# Altium schematic sheet Displaying Unit.SchDoc
size B; SheetNumber: 1; SheetTotal: 1
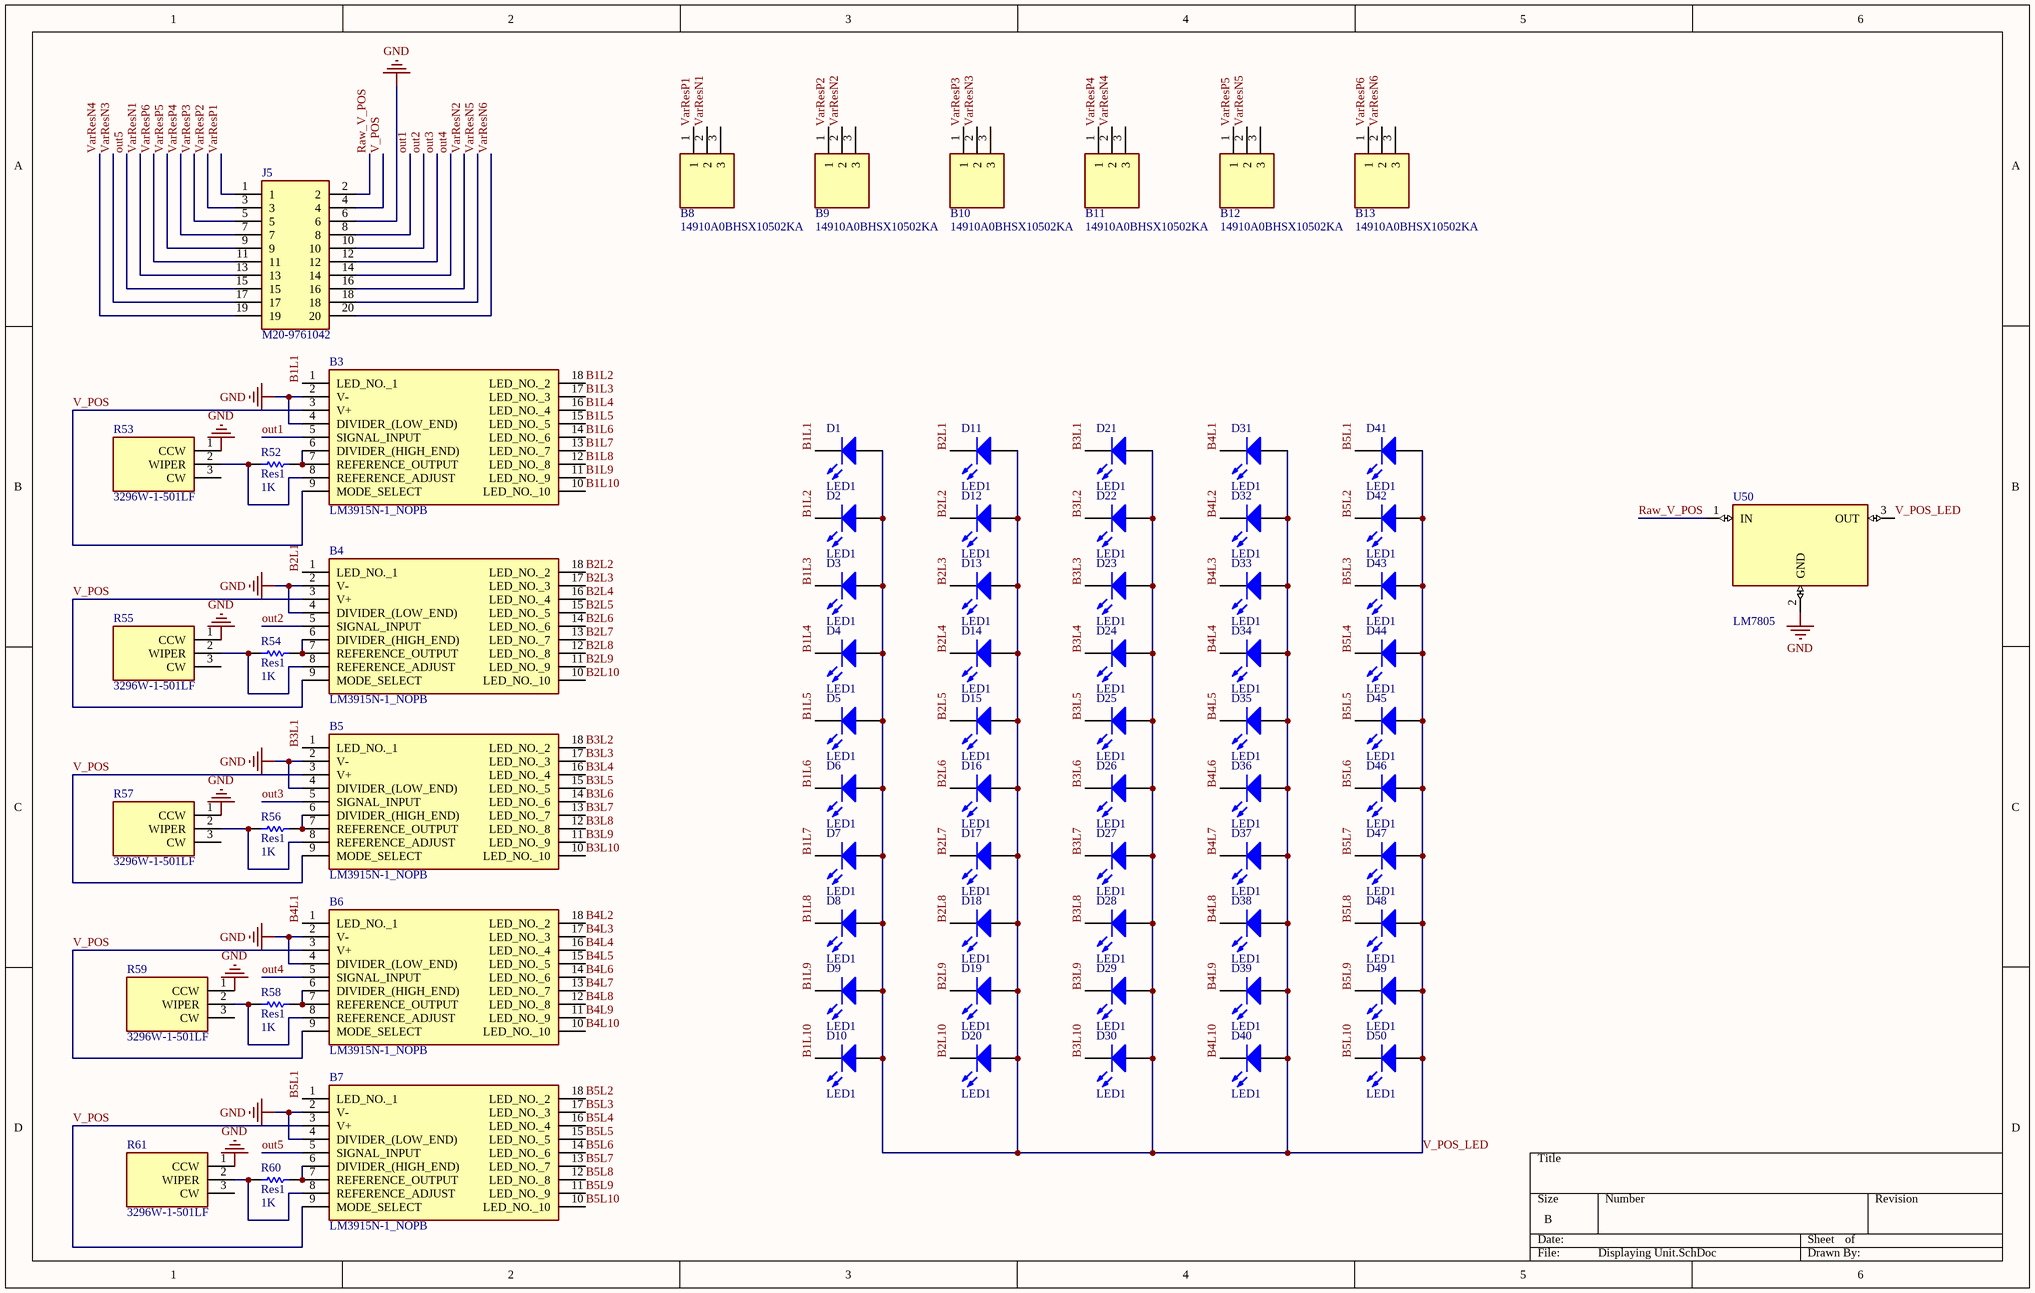
[diagram p0: Displaying Unit.SchDoc]

## Parts
B3  LM3915N-1_NOPB  [DIP794W56P254L2286H533Q18N]
B4  LM3915N-1_NOPB  [DIP794W56P254L2286H533Q18N]
B5  LM3915N-1_NOPB  [DIP794W56P254L2286H533Q18N]
B6  LM3915N-1_NOPB  [DIP794W56P254L2286H533Q18N]
B7  LM3915N-1_NOPB  [DIP794W56P254L2286H533Q18N]
B8  14910A0BHSX10502KA  [14910F0GJSX10103KA]
B9  14910A0BHSX10502KA  [14910F0GJSX10103KA]
B10  14910A0BHSX10502KA  [14910F0GJSX10103KA]
B11  14910A0BHSX10502KA  [14910F0GJSX10103KA]
B12  14910A0BHSX10502KA  [14910F0GJSX10103KA]
B13  14910A0BHSX10502KA  [14910F0GJSX10103KA]
D1  LED1  [LED-1]
D2  LED1  [LED-1]
D3  LED1  [LED-1]
D4  LED1  [LED-1]
D5  LED1  [LED-1]
D6  LED1  [LED-1]
D7  LED1  [LED-1]
D8  LED1  [LED-1]
D9  LED1  [LED-1]
D10  LED1  [LED-1]
D11  LED1  [LED-1]
D12  LED1  [LED-1]
D13  LED1  [LED-1]
D14  LED1  [LED-1]
D15  LED1  [LED-1]
D16  LED1  [LED-1]
D17  LED1  [LED-1]
D18  LED1  [LED-1]
D19  LED1  [LED-1]
D20  LED1  [LED-1]
D21  LED1  [LED-1]
D22  LED1  [LED-1]
D23  LED1  [LED-1]
D24  LED1  [LED-1]
D25  LED1  [LED-1]
D26  LED1  [LED-1]
D27  LED1  [LED-1]
D28  LED1  [LED-1]
D29  LED1  [LED-1]
D30  LED1  [LED-1]
D31  LED1  [LED-1]
D32  LED1  [LED-1]
D33  LED1  [LED-1]
D34  LED1  [LED-1]
D35  LED1  [LED-1]
D36  LED1  [LED-1]
D37  LED1  [LED-1]
D38  LED1  [LED-1]
D39  LED1  [LED-1]
D40  LED1  [LED-1]
D41  LED1  [LED-1]
D42  LED1  [LED-1]
D43  LED1  [LED-1]
D44  LED1  [LED-1]
D45  LED1  [LED-1]
D46  LED1  [LED-1]
D47  LED1  [LED-1]
D48  LED1  [LED-1]
D49  LED1  [LED-1]
D50  LED1  [LED-1]
J5  M20-9761042  [HDRV20W64P254_2X10_2540X508X838P]
R52  Res1  value 1K  [AXIAL-0.3]
R53  3296W-1-501LF  [3296W1501LF]
R54  Res1  value 1K  [AXIAL-0.3]
R55  3296W-1-501LF  [3296W1501LF]
R56  Res1  value 1K  [AXIAL-0.3]
R57  3296W-1-501LF  [3296W1501LF]
R58  Res1  value 1K  [AXIAL-0.3]
R59  3296W-1-501LF  [3296W1501LF]
R60  Res1  value 1K  [AXIAL-0.3]
R61  3296W-1-501LF  [3296W1501LF]
U50  LM7805  [TO220]

## Nets
GND: B3.2(V-) B3.4(DIVIDER_(LOW_END)) B4.2(V-) B4.4(DIVIDER_(LOW_END)) B5.2(V-) B5.4(DIVIDER_(LOW_END)) B6.2(V-) B6.4(DIVIDER_(LOW_END)) B7.2(V-) B7.4(DIVIDER_(LOW_END)) J5.6 R53.1(CCW) R55.1(CCW) R57.1(CCW) R59.1(CCW) R61.1(CCW) U50.2(GND)
B1L1: B3.1(LED_NO._1) D1.2(K)
B1L2: B3.18(LED_NO._2) D2.2(K)
B1L3: B3.17(LED_NO._3) D3.2(K)
B1L4: B3.16(LED_NO._4) D4.2(K)
B1L5: B3.15(LED_NO._5) D5.2(K)
B1L6: B3.14(LED_NO._6) D6.2(K)
B1L7: B3.13(LED_NO._7) D7.2(K)
B1L8: B3.12(LED_NO._8) D8.2(K)
B1L9: B3.11(LED_NO._9) D9.2(K)
B1L10: B3.10(LED_NO._10) D10.2(K)
B2L1: B4.1(LED_NO._1) D11.2(K)
B2L2: B4.18(LED_NO._2) D12.2(K)
B2L3: B4.17(LED_NO._3) D13.2(K)
B2L4: B4.16(LED_NO._4) D14.2(K)
B2L5: B4.15(LED_NO._5) D15.2(K)
B2L6: B4.14(LED_NO._6) D16.2(K)
B2L7: B4.13(LED_NO._7) D17.2(K)
B2L8: B4.12(LED_NO._8) D18.2(K)
B2L9: B4.11(LED_NO._9) D19.2(K)
B2L10: B4.10(LED_NO._10) D20.2(K)
B3L1: B5.1(LED_NO._1) D21.2(K)
B3L2: B5.18(LED_NO._2) D22.2(K)
B3L3: B5.17(LED_NO._3) D23.2(K)
B3L4: B5.16(LED_NO._4) D24.2(K)
B3L5: B5.15(LED_NO._5) D25.2(K)
B3L6: B5.14(LED_NO._6) D26.2(K)
B3L7: B5.13(LED_NO._7) D27.2(K)
B3L8: B5.12(LED_NO._8) D28.2(K)
B3L9: B5.11(LED_NO._9) D29.2(K)
B3L10: B5.10(LED_NO._10) D30.2(K)
B4L1: B6.1(LED_NO._1) D31.2(K)
B4L2: B6.18(LED_NO._2) D32.2(K)
B4L3: B6.17(LED_NO._3) D33.2(K)
B4L4: B6.16(LED_NO._4) D34.2(K)
B4L5: B6.15(LED_NO._5) D35.2(K)
B4L6: B6.14(LED_NO._6) D36.2(K)
B4L7: B6.13(LED_NO._7) D37.2(K)
B4L8: B6.12(LED_NO._8) D38.2(K)
B4L9: B6.11(LED_NO._9) D39.2(K)
B4L10: B6.10(LED_NO._10) D40.2(K)
B5L1: B7.1(LED_NO._1) D41.2(K)
B5L2: B7.18(LED_NO._2) D42.2(K)
B5L3: B7.17(LED_NO._3) D43.2(K)
B5L4: B7.16(LED_NO._4) D44.2(K)
B5L5: B7.15(LED_NO._5) D45.2(K)
B5L6: B7.14(LED_NO._6) D46.2(K)
B5L7: B7.13(LED_NO._7) D47.2(K)
B5L8: B7.12(LED_NO._8) D48.2(K)
B5L9: B7.11(LED_NO._9) D49.2(K)
B5L10: B7.10(LED_NO._10) D50.2(K)
out1: B3.5(SIGNAL_INPUT) J5.8
out2: B4.5(SIGNAL_INPUT) J5.10
out3: B5.5(SIGNAL_INPUT) J5.12
out4: B6.5(SIGNAL_INPUT) J5.14
out5: B7.5(SIGNAL_INPUT) J5.15
Raw_V_POS: J5.2 U50.1(IN)
V_POS: B3.3(V+) B3.9(MODE_SELECT) B4.3(V+) B4.9(MODE_SELECT) B5.3(V+) B5.9(MODE_SELECT) B6.3(V+) B6.9(MODE_SELECT) B7.3(V+) B7.9(MODE_SELECT) J5.4
V_POS_LED: D1.1(A) D2.1(A) D3.1(A) D4.1(A) D5.1(A) D6.1(A) D7.1(A) D8.1(A) D9.1(A) D10.1(A) D11.1(A) D12.1(A) D13.1(A) D14.1(A) D15.1(A) D16.1(A) D17.1(A) D18.1(A) D19.1(A) D20.1(A) D21.1(A) D22.1(A) D23.1(A) D24.1(A) D25.1(A) D26.1(A) D27.1(A) D28.1(A) D29.1(A) D30.1(A) D31.1(A) D32.1(A) D33.1(A) D34.1(A) D35.1(A) D36.1(A) D37.1(A) D38.1(A) D39.1(A) D40.1(A) D41.1(A) D42.1(A) D43.1(A) D44.1(A) D45.1(A) D46.1(A) D47.1(A) D48.1(A) D49.1(A) D50.1(A) U50.3(OUT)
VarResN1: B8.2 J5.13
VarResN2: B9.2 J5.16
VarResN3: B10.2 J5.17
VarResN4: B11.2 J5.19
VarResN5: B12.2 J5.18
VarResN6: B13.2 J5.20
VarResP1: B8.1 J5.1
VarResP2: B9.1 J5.3
VarResP3: B10.1 J5.5
VarResP4: B11.1 J5.7
VarResP5: B12.1 J5.9
VarResP6: B13.1 J5.11
NetB3_6: B3.6(DIVIDER_(HIGH_END)) B3.7(REFERENCE_OUTPUT) R52.2
NetB3_8: B3.8(REFERENCE_ADJUST) R52.1 R53.2(WIPER)
NetB4_6: B4.6(DIVIDER_(HIGH_END)) B4.7(REFERENCE_OUTPUT) R54.2
NetB4_8: B4.8(REFERENCE_ADJUST) R54.1 R55.2(WIPER)
NetB5_6: B5.6(DIVIDER_(HIGH_END)) B5.7(REFERENCE_OUTPUT) R56.2
NetB5_8: B5.8(REFERENCE_ADJUST) R56.1 R57.2(WIPER)
NetB6_6: B6.6(DIVIDER_(HIGH_END)) B6.7(REFERENCE_OUTPUT) R58.2
NetB6_8: B6.8(REFERENCE_ADJUST) R58.1 R59.2(WIPER)
NetB7_6: B7.6(DIVIDER_(HIGH_END)) B7.7(REFERENCE_OUTPUT) R60.2
NetB7_8: B7.8(REFERENCE_ADJUST) R60.1 R61.2(WIPER)

Not connected (* = marked no-connect by the designer): B8 3; B9 3; B10 3; B11 3; B12 3; B13 3; R53 3(CW); R55 3(CW); R57 3(CW); R59 3(CW); R61 3(CW)

## Library data of the parts
B3-B7 = LM3915N-1_NOPB: Logarithmic bargraph driver,LM3915N-1 Texas Instruments LM3915N-1/NOPB, LED Driver, 10-Digits 10-Segments, 3.3 V, 5 V, 9 V, 12 V, 15 V, 18 V, 24 V, 18-Pin; Geometry.Height: 5.334mm; Manufacturer_Name: Texas Instruments; Manufacturer_Part_Number: LM3915N-1/NOPB; Mouser Part Number: 926-LM3915N-1/NOPB; Mouser Price/Stock: https://www.mouser.co.uk/ProductDetail/Texas-Instruments/LM3915N-1-NOPB?qs=QbsRYf82W3Fo14xSwohWxQ%3D%3D; Arrow Part Number: *; Arrow Price/Stock: *; Mouser Testing Part Number: *; Mouser Testing Price/Stock: *; Datasheet Link: http://media.digikey.com/pdf/Data%20Sheets/Texas%20Instruments%20PDFs/LM3915.pdf
B8-B13 = 14910A0BHSX10502KA: Potentiometers 1/2' SQ 1/4'S 5Kohms Cermet; Manufacturer_Name: Vishay; Manufacturer_Part_Number: 14910A0BHSX10502KA; Mouser Part Number: 594-14910A0BHSP502KA; Mouser Price/Stock: https://www.mouser.co.uk/ProductDetail/Vishay-Spectrol/14910A0BHSX10502KA?qs=sKxHajcpPaBuEjDBnLxOZg%3D%3D; Arrow Part Number: *; Arrow Price/Stock: *; Mouser Testing Part Number: *; Mouser Testing Price/Stock: *; Datasheet Link: https://www.mouser.com/datasheet/2/427/148149-239924.pdf
D1-D50 = LED1: Typical RED GaAs LED; Published: 8-Jun-2000; LatestRevisionDate: 08-Jul-2005; LatestRevisionNote: Mech Layer 1 removed.; PackageReference: LED-1; Publisher: Altium Limited; PackageDescription: LED; 2 Leads
J5 = M20-9761042: Headers & Wire Housings 10+10 DIL VERTICAL PIN HEADER GOLD+TIN; Manufacturer_Name: Harwin; Geometry.Height: 8.38mm; Manufacturer_Part_Number: M20-9761042; Mouser Part Number: 855-M20-9761042; Mouser Price/Stock: https://www.mouser.co.uk/ProductDetail/Harwin/M20-9761042?qs=vF78I%252BjhbY%2Fp44UYNx369Q%3D%3D; Arrow Part Number: *; Arrow Price/Stock: *; Mouser Testing Part Number: *; Mouser Testing Price/Stock: *; Datasheet Link: https://cdn.harwin.com/pdfs/M20-976.pdf
R52 R54 R56 R58 R60 = Res1: Resistor; Published: 8-Jun-2000; LatestRevisionDate: 17-Jul-2002; LatestRevisionNote: Re-released for DXP Platform.; PackageReference: AXIAL-0.3; Publisher: Altium Limited; PackageDescription: Axial Device, Thru-Hole; 2 Leads; 0.3 in Pin Spacing
R53 R55 R57 R59 R61 = 3296W-1-501LF: Trimmer Resistors - Through Hole 3/8IN 500 OHM Sealed Vertical Adjust; Manufacturer_Name: Bourns; Geometry.Height: 11.8mm; Manufacturer_Part_Number: 3296W-1-501LF; Mouser Part Number: 652-3296W-1-501LF; Mouser Price/Stock: https://www.mouser.co.uk/ProductDetail/Bourns/3296W-1-501LF?qs=jv1NtkgVBglZfwkzTzmOUg%3D%3D; Arrow Part Number: 3296W-1-501LF; Arrow Price/Stock: https://www.arrow.com/en/products/3296w-1-501lf/bourns?region=europe; Mouser Testing Part Number: *; Mouser Testing Price/Stock: *; Datasheet Link: https://datasheet.datasheetarchive.com/originals/dk/DKDS-12/224533.pdf
U50 = LM7805: Linear Voltage Regulator IC Positive Fixed 1 Output 1.5A DDPAK/TO-263-3; MF: Texas Instruments; Price: None; Availability: In Stock; MP: LM7805; Package: None; SnapEDA_Link: https://www.snapeda.com/parts/LM7805/Texas+Instruments/view-part/?ref=snap; Check_prices: https://www.snapeda.com/parts/LM7805/Texas+Instruments/view-part/?ref=eda; Value: *; Purchase-URL: https://pricing.snapeda.com/search/part/LM7805/?ref=eda